# Altium schematic sheet FLASH_SD_CARD.SchDoc
size 420 x 297 mm; SheetNumber: 18; SheetTotal: 23
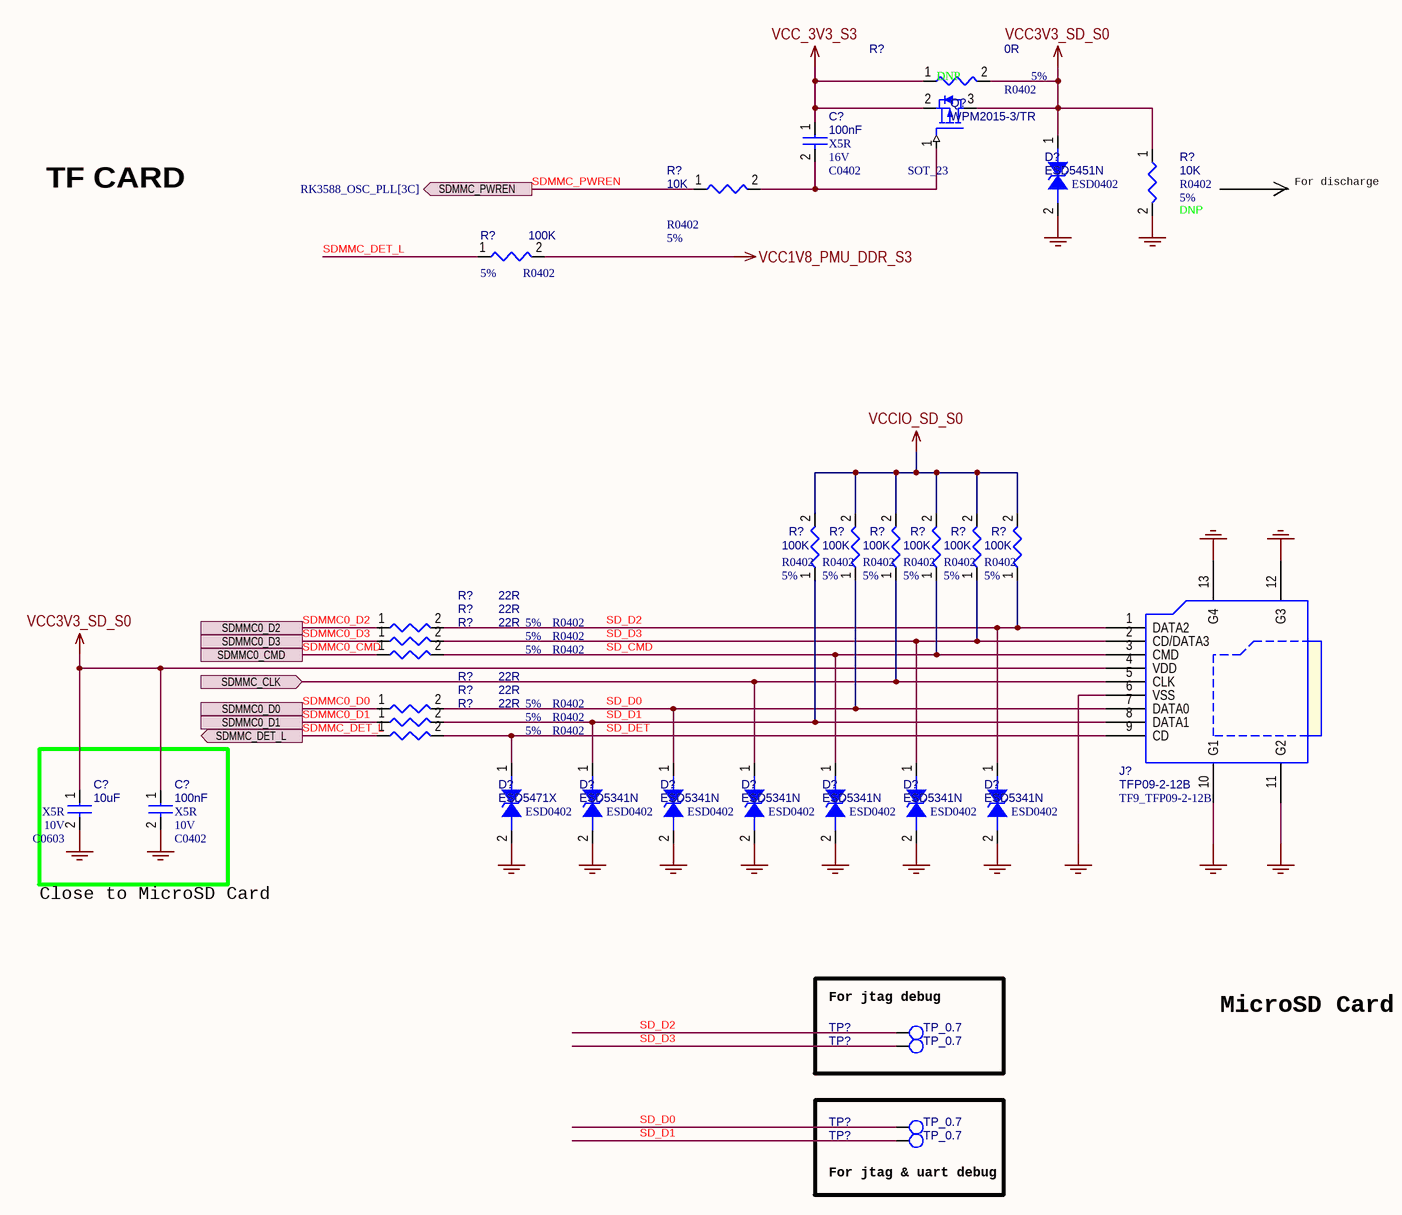
[diagram p0: FLASH_SD_CARD.SchDoc]

## Parts
(Parts that share a designator on the sheet are numbered #1, #2 ... from top to bottom, then left to right.)
C?#1  100nF  Dielectric: X5R  Voltage: 16V  [C0402]
C?#2  10uF  Dielectric: X5R  Voltage: 10V  [C0603]
C?#3  100nF  Dielectric: X5R  Voltage: 10V  [C0402]
D?#1  ESD5451N  [ESD0402]
D?#2  ESD5471X  [ESD0402]
D?#3  ESD5341N  [ESD0402]
D?#4  ESD5341N  [ESD0402]
D?#5  ESD5341N  [ESD0402]
D?#6  ESD5341N  [ESD0402]
D?#7  ESD5341N  [ESD0402]
D?#8  ESD5341N  [ESD0402]
J?  TFP09-2-12B  PCB Footprint: TF9_TFP09-2-12B  [TF-CKT01-009D]
Q?  WPM2015-3/TR  PCB Footprint: SOT_23  [SOT23]
R?#1  0R  Tolerance: 5%  option: DNP  [R0402]
R?#2  10K  Tolerance: 5%  option: DNP  [R0402]
R?#3  10K  Tolerance: 5%  [R0402]
R?#4  100K  Tolerance: 5%  [R0402]
R?#5  100K  Tolerance: 5%  [R0402]
R?#6  100K  Tolerance: 5%  [R0402]
R?#7  100K  Tolerance: 5%  [R0402]
R?#8  100K  Tolerance: 5%  [R0402]
R?#9  100K  Tolerance: 5%  [R0402]
R?#10  100K  Tolerance: 5%  [R0402]
R?#11  22R  Tolerance: 5%  [R0402]
R?#12  22R  Tolerance: 5%  [R0402]
R?#13  22R  Tolerance: 5%  [R0402]
R?#14  22R  Tolerance: 5%  [R0402]
R?#15  22R  Tolerance: 5%  [R0402]
R?#16  22R  Tolerance: 5%  [R0402]
TP?#1  TP_0.7  [TEST]
TP?#2  TP_0.7  [TEST]
TP?#3  TP_0.7  [TEST]
TP?#4  TP_0.7  [TEST]

## Blocks framed on the sheet
For jtag debug: TP?#1 TP?#2
For jtag & uart debug: TP?#3 TP?#4

## Ports
SDMMC0_CMD (see RK3588_FLASH_SD_EMMC[4C]), SDMMC0_D0 (see RK3588_FLASH_SD_EMMC[4C]), SDMMC0_D1 (see RK3588_FLASH_SD_EMMC[4C]), SDMMC0_D2 (see RK3588_FLASH_SD_EMMC[4C]), SDMMC0_D3 (see RK3588_FLASH_SD_EMMC[4C]), SDMMC_CLK (in, see RK3588_FLASH_SD_EMMC[4C]), SDMMC_DET_L (out, see RK3588_OSC_PLL[4B]), SDMMC_PWREN (out, see RK3588_OSC_PLL[3C])

## Nets
GND: C?#2.2 C?#3.2 D?#1.2 D?#2.2 D?#3.2 D?#4.2 D?#5.2 D?#6.2 D?#7.2 D?#8.2 J?.6(VSS) J?.10(G1) J?.11(G2) J?.12(G3) J?.13(G4) R?#2.2
VCC1V8_PMU_DDR_S3: R?#4.2
VCC3V3_SD_S0: C?#2.1 C?#3.1 D?#1.1 J?.4(VDD) Q?.3(DRAIN) R?#1.2 R?#2.1
VCC_3V3_S3: C?#1.1 Q?.2(SOURCE) R?#1.1
VCCIO_SD_S0: R?#5.2 R?#6.2 R?#7.2 R?#8.2 R?#9.2 R?#10.2
SD_CMD: D?#6.1 J?.3(CMD) R?#8.1 R?#13.2
SD_D0: D?#4.1 J?.7(DATA0) R?#6.1 R?#14.2 TP?#3.1
SD_D1: D?#3.1 J?.8(DATA1) R?#5.1 R?#15.2 TP?#4.1
SD_D2: D?#8.1 J?.1(DATA2) R?#10.1 R?#11.2 TP?#1.1
SD_D3: D?#7.1 J?.2(CD/DATA3) R?#9.1 R?#12.2 TP?#2.1
SD_DET: D?#2.1 J?.9(CD) R?#16.2
SDMMC0_CMD: R?#13.1 ; port SDMMC0_CMD
SDMMC0_D0: R?#14.1 ; port SDMMC0_D0
SDMMC0_D1: R?#15.1 ; port SDMMC0_D1
SDMMC0_D2: R?#11.1 ; port SDMMC0_D2
SDMMC0_D3: R?#12.1 ; port SDMMC0_D3
SDMMC_CLK: D?#5.1 J?.5(CLK) R?#7.1 ; port SDMMC_CLK
SDMMC_DET_L: R?#4.1 R?#16.1 ; port SDMMC_DET_L
SDMMC_PWREN: R?#3.1 ; port SDMMC_PWREN
NetC?#1_2: C?#1.2 Q?.1(GATE) R?#3.2

## Notes on the sheet
- For discharge
- TF CARD
- Close to MicroSD Card
- MicroSD Card
- 297x420
- Формат А3

## Library data of the parts
C?#1 = CAP NP_Dup1: cap,100.00nF,+/-10%,16V,X5R,C0402; Part Reference: C4200; Manufacturer: TDK; Number: 37; RK PN: C1005X5R1C104K050BA; Priority: A; Tolerance: 10%; C_Voltage: 6.3V; PCB Footprint: C0402; Value: 100nF; Part Type: C0402; Manufacturer PN: C1005X5R1C104K050BA; Created by: JJJ
C?#2 = CAP NP_Dup1: cap,10.00uF,+/-10%,10V,X5R,C0603; Part Reference: C4201; Manufacturer PN: C1608X5R1A106K080AC; Manufacturer: TDK; Tolerance: 10%; C_Voltage: 6.3V; Priority: A; PCB Footprint: C0603; Value: 10uF; Created by: JJJ; Part Type: C0603; RK PN: C1608X5R1A106K080AC
C?#3 = CAP NP_Dup1: cap,100.00nF,+/-10%,10V,X5R,C0402; Part Reference: C4202; Manufacturer PN: C1005X5R1A104K050BA; Manufacturer: TDK; C_Voltage: 6.3V; Tolerance: 10%; Priority: A; Number: 37; PCB Footprint: C0402; Value: 100nF; Created by: JJJ; Part Type: C0402; RK PN: C1005X5R1A104K050BA
D?#1 = DIODE BI_DIR TRIG: 1-Line, Bi-directional, Transient Voltage Suppressors.17.5pF.; Part Reference: D4200; Manufacturer: WillSemi(О¤¶ы°лµјМе); Priority: A; PCB Footprint: ESD0402; Value: ESD5451N; RK PN: ESD5451N; Part Type: ESD_TVS; Manufacturer PN: ESD5451N; Created by: JJJ
D?#2 = DIODE BI_DIR TRIG: 1-Line, Bi-directional, Transient Voltage Suppressors.9pF.; Part Reference: D4201; Manufacturer: WillSemi(О¤¶ы°лµјМе); Priority: A; PCB Footprint: ESD0402; Value: ESD5471X; Created by: JJJ; Manufacturer PN: ESD5471X; Part Type: ESD_TVS; RK PN: ESD5471X
D?#3 = DIODE BI_DIR TRIG: 1-Line, Bi-directional, Transient Voltage Suppressors.1pF.; Part Reference: D4202; Manufacturer: WillSemi(О¤¶ы°лµјМе); Priority: A; PCB Footprint: ESD0402; Value: ESD5341N; Created by: JJJ; Manufacturer PN: ESD5341N; Part Type: ESD_TVS; RK PN: ESD5341N
D?#4 = DIODE BI_DIR TRIG: 1-Line, Bi-directional, Transient Voltage Suppressors.1pF.; Part Reference: D4203; Manufacturer: WillSemi(О¤¶ы°лµјМе); Priority: A; PCB Footprint: ESD0402; Value: ESD5341N; Created by: JJJ; Manufacturer PN: ESD5341N; Part Type: ESD_TVS; RK PN: ESD5341N
D?#5 = DIODE BI_DIR TRIG: 1-Line, Bi-directional, Transient Voltage Suppressors.1pF.; Part Reference: D4204; Manufacturer: WillSemi(О¤¶ы°лµјМе); Priority: A; PCB Footprint: ESD0402; Value: ESD5341N; RK PN: ESD5341N; Part Type: ESD_TVS; Manufacturer PN: ESD5341N; Created by: JJJ
D?#6 = DIODE BI_DIR TRIG: 1-Line, Bi-directional, Transient Voltage Suppressors.1pF.; Part Reference: D4205; Manufacturer: WillSemi(О¤¶ы°лµјМе); Priority: A; PCB Footprint: ESD0402; Value: ESD5341N; RK PN: ESD5341N; Part Type: ESD_TVS; Manufacturer PN: ESD5341N; Created by: JJJ
D?#7 = DIODE BI_DIR TRIG: 1-Line, Bi-directional, Transient Voltage Suppressors.1pF.; Part Reference: D4206; Manufacturer: WillSemi(О¤¶ы°лµјМе); Priority: A; PCB Footprint: ESD0402; Value: ESD5341N; RK PN: ESD5341N; Part Type: ESD_TVS; Manufacturer PN: ESD5341N; Created by: JJJ
D?#8 = DIODE BI_DIR TRIG: 1-Line, Bi-directional, Transient Voltage Suppressors.1pF.; Part Reference: D4207; Manufacturer: WillSemi(О¤¶ы°лµјМе); Priority: A; PCB Footprint: ESD0402; Value: ESD5341N; RK PN: ESD5341N; Part Type: ESD_TVS; Manufacturer PN: ESD5341N; Created by: JJJ
J? = TFCARD_SOCKET: НЁУГTFїЁЧщЈ¬И«іЯґз; Part Reference: J4200; Manufacturer: НъїЖґп; Priority: A; Value: TFP09-2-12B; Created by: JJJ; Manufacturer Part Number: TFP09-2-12B; Part Type: CARD Jack; RK PN: TFP09-2-12B
Q? = MOSFET P: PMOS,WPM2015-3/TR,SOT_23,Id=2.4A,Vds=20V; Part Reference: Q4200; Manufacturer: WillSemi(О¤¶ы°лµјМе); ROOM: CHG; Priority: A; Id_max: 2.4A; Vgs: ЎА8V; VDS: 20V; Vgsth: 0.62V; Pd: 0.5W; Value: WPM2015-3/TR; RK PN: WPM2015-3/TR; Part Type: PMOS; Manufacturer PN: WPM2015-3/TR; Created by: JJJ
R?#1 = RESISTOR_Dup2: НЁУГєсД¤µзЧи,0R,+/-5%,R0402,1/16W.; Part Reference: R4200; Manufacturer: YAGEO; RK PN: RC0402JR-070RL; Priority: A; Wattage: 1/16W; PCB Footprint: R0402; Value: 0R; Part Type: НЁУГєсД¤µзЧи; Manufacturer PN: RC0402JR-070RL; Created by: YTL
R?#2 = RESISTOR_Dup2: НЁУГєсД¤µзЧи,10K,+/-5%,R0402,1/16W.; Part Reference: R4202; Manufacturer PN: RC0402JR-0710KL; Manufacturer: YAGEO; Wattage: 1/16W; Priority: A; PCB Footprint: R0402; Value: 10K; Created by: YTL; Part Type: НЁУГєсД¤µзЧи; RK PN: RC0402JR-0710KL
R?#3 = RESISTOR_Dup2: НЁУГєсД¤µзЧи,10K,+/-5%,R0402,1/16W.; Part Reference: R4201; Manufacturer PN: RC0402JR-0710KL; Manufacturer: YAGEO; Wattage: 1/16W; Priority: A; PCB Footprint: R0402; Value: 10K; Created by: YTL; Part Type: НЁУГєсД¤µзЧи; RK PN: RC0402JR-0710KL
R?#4-R?#10 = RESISTOR_Dup2: НЁУГєсД¤µзЧи,100K,+/-5%,R0402,1/16W.; Part Reference: R4203; Manufacturer: YAGEO; RK PN: RC0402JR-07100KL; Priority: A; Wattage: 1/16W; PCB Footprint: R0402; Value: 100K; Part Type: НЁУГєсД¤µзЧи; Manufacturer PN: RC0402JR-07100KL; Created by: YTL
R?#11 = RESISTOR_Dup2: НЁУГєсД¤µзЧи,22R,+/-5%,R0402,1/16W.; Part Reference: R4204; Manufacturer: YAGEO; RK PN: RC0402JR-0722RL; Priority: A; Wattage: 1/16W; PCB Footprint: R0402; Value: 22R; Part Type: НЁУГєсД¤µзЧи; Manufacturer PN: RC0402JR-0722RL; Created by: YTL
R?#12 = RESISTOR_Dup2: НЁУГєсД¤µзЧи,22R,+/-5%,R0402,1/16W.; Part Reference: R4205; Manufacturer: YAGEO; RK PN: RC0402JR-0722RL; Priority: A; Wattage: 1/16W; PCB Footprint: R0402; Value: 22R; Part Type: НЁУГєсД¤µзЧи; Manufacturer PN: RC0402JR-0722RL; Created by: YTL
R?#13 = RESISTOR_Dup2: НЁУГєсД¤µзЧи,22R,+/-5%,R0402,1/16W.; Part Reference: R4206; Manufacturer: YAGEO; RK PN: RC0402JR-0722RL; Priority: A; Wattage: 1/16W; PCB Footprint: R0402; Value: 22R; Part Type: НЁУГєсД¤µзЧи; Manufacturer PN: RC0402JR-0722RL; Created by: YTL
R?#14 = RESISTOR_Dup2: НЁУГєсД¤µзЧи,22R,+/-5%,R0402,1/16W.; Part Reference: R4207; Manufacturer PN: RC0402JR-0722RL; Manufacturer: YAGEO; Wattage: 1/16W; Priority: A; PCB Footprint: R0402; Value: 22R; Created by: YTL; Part Type: НЁУГєсД¤µзЧи; RK PN: RC0402JR-0722RL
R?#15 = RESISTOR_Dup2: НЁУГєсД¤µзЧи,22R,+/-5%,R0402,1/16W.; Part Reference: R4208; Manufacturer PN: RC0402JR-0722RL; Manufacturer: YAGEO; Wattage: 1/16W; Priority: A; PCB Footprint: R0402; Value: 22R; Created by: YTL; Part Type: НЁУГєсД¤µзЧи; RK PN: RC0402JR-0722RL
R?#16 = RESISTOR_Dup2: НЁУГєсД¤µзЧи,22R,+/-5%,R0402,1/16W.; Part Reference: R4209; Manufacturer PN: RC0402JR-0722RL; Manufacturer: YAGEO; Wattage: 1/16W; Priority: A; PCB Footprint: R0402; Value: 22R; Created by: YTL; Part Type: НЁУГєсД¤µзЧи; RK PN: RC0402JR-0722RL
TP?#1 = TP: Test Point 0.7mm; Part Reference: TP4200; PCB Footprint: TP_0R70; Priority: A; RK PN: TESTPOINT_0R7; Value: TP_0.7; Created by: JJJ; Part Type: TP
TP?#2 = TP: Test Point 0.7mm; Part Reference: TP4201; PCB Footprint: TP_0R70; RK PN: TESTPOINT_0R7; Priority: A; Value: TP_0.7; Part Type: TP; Created by: JJJ
TP?#3 = TP: Test Point 0.7mm; Part Reference: TP4202; PCB Footprint: TP_0R70; Priority: A; RK PN: TESTPOINT_0R7; Value: TP_0.7; Created by: JJJ; Part Type: TP
TP?#4 = TP: Test Point 0.7mm; Part Reference: TP4203; PCB Footprint: TP_0R70; Priority: A; RK PN: TESTPOINT_0R7; Value: TP_0.7; Created by: JJJ; Part Type: TP